# Altium schematic sheet VolksEEG.SchDoc
size A; SheetNumber: 1; SheetTotal: 5
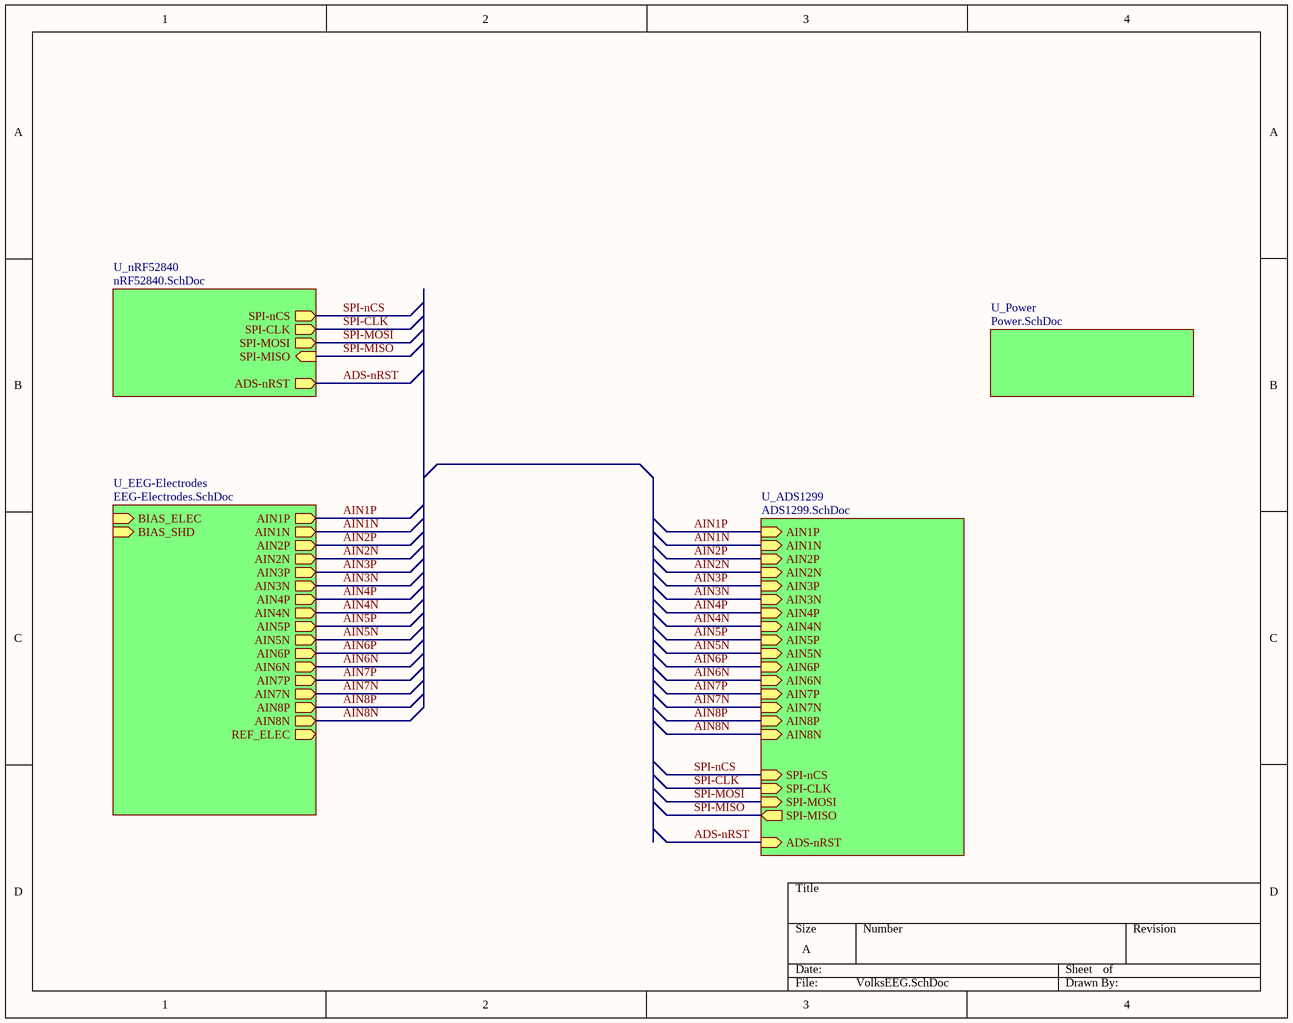
[diagram p0: VolksEEG.SchDoc]

## Sub-sheets
U_ADS1299 = ADS1299.SchDoc: AIN1P (in), AIN1N (in), AIN2P (in), AIN2N (in), AIN3P (in), AIN3N (in), AIN4P (in), AIN4N (in), AIN5P (in), AIN5N (in), AIN6P (in), AIN6N (in), AIN7P (in), AIN7N (in), AIN8P (in), AIN8N (in), SPI-MOSI (in), ADS-nRST (in), SPI-MISO (out), SPI-nCS (in), SPI-CLK (in)
U_EEG-Electrodes = EEG-Electrodes.SchDoc: AIN1P (out), AIN1N (out), AIN2P (out), AIN2N (out), AIN3P (out), AIN3N (out), AIN4P (out), AIN4N (out), AIN5P (out), AIN5N (out), AIN6P (out), AIN6N (out), AIN7P (out), AIN7N (out), AIN8P (out), AIN8N (out), REF_ELEC (out), BIAS_ELEC (in), BIAS_SHD (in)
U_nRF52840 = nRF52840.SchDoc: SPI-nCS (out), SPI-MISO (in), SPI-CLK (out), ADS-nRST (out), SPI-MOSI (out)
U_Power = Power.SchDoc: no entries

## Nets
ADS-nRST: sheet U_nRF52840/ADS-nRST, sheet U_ADS1299/ADS-nRST
AIN1N: sheet U_ADS1299/AIN1N, sheet U_EEG-Electrodes/AIN1N
AIN1P: sheet U_ADS1299/AIN1P, sheet U_EEG-Electrodes/AIN1P
AIN2N: sheet U_ADS1299/AIN2N, sheet U_EEG-Electrodes/AIN2N
AIN2P: sheet U_ADS1299/AIN2P, sheet U_EEG-Electrodes/AIN2P
AIN3N: sheet U_ADS1299/AIN3N, sheet U_EEG-Electrodes/AIN3N
AIN3P: sheet U_ADS1299/AIN3P, sheet U_EEG-Electrodes/AIN3P
AIN4N: sheet U_ADS1299/AIN4N, sheet U_EEG-Electrodes/AIN4N
AIN4P: sheet U_ADS1299/AIN4P, sheet U_EEG-Electrodes/AIN4P
AIN5N: sheet U_ADS1299/AIN5N, sheet U_EEG-Electrodes/AIN5N
AIN5P: sheet U_ADS1299/AIN5P, sheet U_EEG-Electrodes/AIN5P
AIN6N: sheet U_ADS1299/AIN6N, sheet U_EEG-Electrodes/AIN6N
AIN6P: sheet U_ADS1299/AIN6P, sheet U_EEG-Electrodes/AIN6P
AIN7N: sheet U_ADS1299/AIN7N, sheet U_EEG-Electrodes/AIN7N
AIN7P: sheet U_ADS1299/AIN7P, sheet U_EEG-Electrodes/AIN7P
AIN8N: sheet U_ADS1299/AIN8N, sheet U_EEG-Electrodes/AIN8N
AIN8P: sheet U_ADS1299/AIN8P, sheet U_EEG-Electrodes/AIN8P
SPI-CLK: sheet U_nRF52840/SPI-CLK, sheet U_ADS1299/SPI-CLK
SPI-MISO: sheet U_nRF52840/SPI-MISO, sheet U_ADS1299/SPI-MISO
SPI-MOSI: sheet U_nRF52840/SPI-MOSI, sheet U_ADS1299/SPI-MOSI
SPI-nCS: sheet U_nRF52840/SPI-nCS, sheet U_ADS1299/SPI-nCS